# Altium project Onduleur.PrjPcb
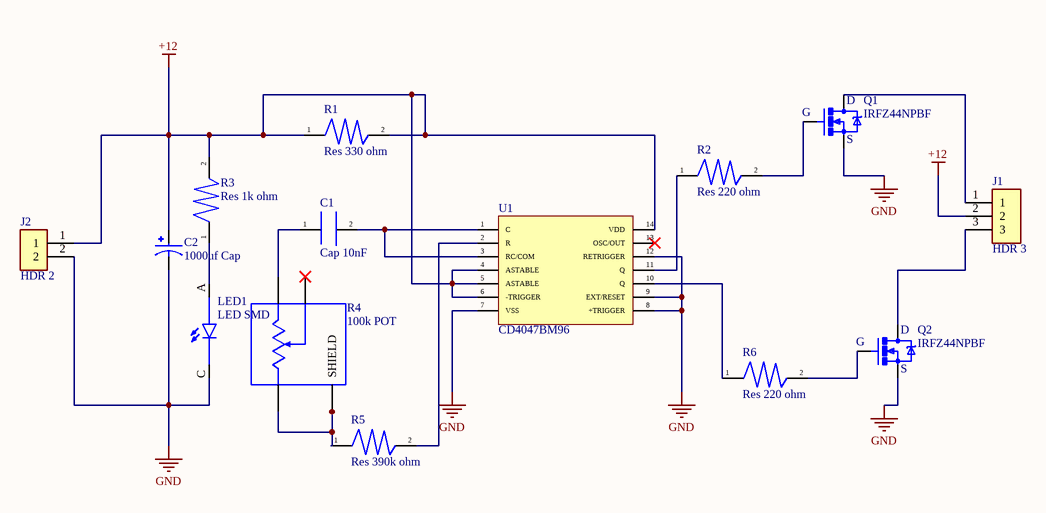
[diagram p0: onduleur.SchDoc]
1 sheet, 14 parts. Net scope: global (net labels, ports and power ports of the same name join across sheets).
Board file: PCB_onduleur.PcbDoc

## Sheet onduleur.SchDoc
size A; SheetNumber: 1; SheetTotal: 1

### Parts
C1  Cap 10nF  [C0805 10nf]
C2  1000uf Cap  [Cap 1000uf]
J1  HDR 3  [HDR 3]
J2  HDR 2  [HDR 2]
LED1  LED SMD  [LED]
Q1  IRFZ44NPBF  [IRF]
Q2  IRFZ44NPBF  [IRF]
R1  Res 330 ohm  [R2010 330 ohm]
R2  Res 220 ohm  [R2512 220ohm]
R3  Res 1k ohm  [R2512 390k]
R4  100k POT  [100k POt]
R5  Res 390k ohm  [R2512 390k]
R6  Res 220 ohm  [R2512 220ohm]
U1  CD4047BM96  [CD4047_SOP14]

### Nets
+12: C2.P J1.2 J2.1 R1.1 R1.2 R3.2 U1.4(ASTABLE) U1.5(ASTABLE) U1.6(-TRIGGER) U1.14(VDD)
GND: C2.N J2.2 LED1.C Q1.3(S) Q2.3(S) U1.7(VSS) U1.8(+TRIGGER) U1.9(EXT/RESET) U1.12(RETRIGGER)
NetC1_1: C1.1 R4.3
NetC1_2: C1.2 U1.1(C) U1.3(RC/COM)
NetJ1_1: J1.1 Q1.2(D)
NetJ1_3: J1.3 Q2.2(D)
NetLED1_A: LED1.A R3.1
NetQ1_1: Q1.1(G) R2.2
NetQ2_1: Q2.1(G) R6.2
NetR2_1: R2.1 U1.11(Q)
NetR4_1: R4.1 R4.S1(SHIELD) R4.S2(SHIELD) R5.1
NetR5_2: R5.2 U1.2(R)
NetR6_1: R6.1 U1.10(Q)

Not connected (* = marked no-connect by the designer): R4 2*; U1 13(OSC/OUT)*

### Library data of the parts
C1 = Cap 10nF: 0805 330 nF 25 V -20 / +80 % Tolerance Y5V SMT Multilayer Ceramic Capacitor; Manufacturer: Kyocera AVX; Manufacturer Part Number: 08053G334ZAT2A; Capacitance: 330nF; Voltage Rating (DC): 25V; Tolerance: 80%; Supplier 1: Digi-Key; RoHS: Yes; Category: Ceramic Capacitors; Stock 1: 7037; Pricing 1: 1=0.33000, 10=0.22400, 50=0.14920, 100=0.12680, 500=0.08950, 1000=0.07831 (USD); Mount: Surface Mount; Case/Package: 0805; Number of Pins: 2; Case Code (Imperial): 0805; Case Code (Metric): 2012; Contact Plating: Tin,Matte; Min Operating Temperature: -30°C; Max Operating Temperature: 85°C; Dielectric: Y5V; Voltage Rating: 25V; Packaging: Tape and Reel; Package Quantity: 1; Termination: SMD/SMT; Series: -; Construction: Flat; Length: 0.079inch; Width: 0.049inch; Height: 0.94mm; Thickness: 0.05inch; Depth: 1.25mm; Radiation Hardening: No; Lead Free: Lead Free; REACH SVHC: No SVHC; RoHS Compliant: Yes; ComponentLink1URL: https://datasheet.ciiva.com/15212/getdatasheetpartid-200149-15212519.pdf?src-supplier=Verical; ComponentLink1Description: https://datasheet.ciiva.com/15212/getdatasheetpartid-200149-15212519.pdf?src-supplier=Verical; ComponentLink2URL: https://datasheet.ciiva.com/152/cy5v-152205.pdf?src-supplier=Digi-Key; ComponentLink2Description: https://datasheet.ciiva.com/152/cy5v-152205.pdf?src-supplier=Digi-Key; ComponentLink3URL: https://datasheet.ciiva.com/152/cy5v-152206.pdf?src-supplier=Digi-Key; ComponentLink3Description: https://datasheet.ciiva.com/152/cy5v-152206.pdf?src-supplier=Digi-Key; ComponentLink4URL: https://datasheet.ciiva.com/152/cy5v-152207.pdf?src-supplier=Digi-Key; ComponentLink4Description: https://datasheet.ciiva.com/152/cy5v-152207.pdf?src-supplier=Digi-Key
C2 = 1000uf Cap: Cap Aluminum 1000uF 50V 20% (12.5 X 25mm) Radial 5mm 950mA 2000 hr 105°C Ammo Pack; Manufacturer: Panasonic; Manufacturer Part Number: EEU-HD1H102B; Capacitance: 1mF; Lead/Base Style: Straight; Life (Hours): 2000Hour; Lead Diameter: 0.6mm; Supplier 1: Digi-Key; RoHS: Yes; Category: Aluminum Electrolytic Capacitors; Stock 1: 1; Pricing 1: 1=2.69000, 10=2.17900, 50=1.90140, 100=1.66370 (USD); Mount: Through Hole; Case/Package: Radial; Min Operating Temperature: -55°C; Max Operating Temperature: 105°C; Package Quantity: 500; Voltage Rating: 50V; Tolerance: 20%; Ripple Current: 950mA; Packaging: Tape and Reel; Voltage Rating (DC): 50V; Features: General Purpose; Termination: Radial; Diameter: 12.5mm; Length: 25mm; Lead Pitch: 5mm; Height - Seated (Max): 1.063inch; ComponentLink1URL: https://datasheet.ciiva.com/30260/32aba0000ce137-30260380.pdf?src-supplier=Onlinecomponents.com; ComponentLink1Description: https://datasheet.ciiva.com/30260/32aba0000ce137-30260380.pdf?src-supplier=Onlinecomponents.com; ComponentLink2URL: https://datasheet.ciiva.com/24071/aba0000ce137-71750-24071852.pdf?src-supplier=Mouser; ComponentLink2Description: https://datasheet.ciiva.com/24071/aba0000ce137-71750-24071852.pdf?src-supplier=Mouser
J1 = HDR 3: 3 Position Wire to Board Terminal Block Horizontal with Board 0.150" (3.81mm) Through Hole; Manufacturer: TE Connectivity; Manufacturer Part Number: 284392-3; Supplier 1: Newark; RoHS: Yes; Category: Terminal Blocks; Stock 1: 2108; Pricing 1: 1=0.49100, 10=0.49100, 25=0.49100, 50=0.49100, 100=0.49100 (USD); ComponentLink1URL: https://datasheet.ciiva.com/823/eng-cd-284392-b1-823460.pdf?src-supplier=Digi-Key; ComponentLink1Description: https://datasheet.ciiva.com/823/eng-cd-284392-b1-823460.pdf?src-supplier=Digi-Key; ComponentLink2URL: https://datasheet.ciiva.com/15169/getdatasheetpartid-47322-15169431.pdf?src-supplier=Verical; ComponentLink2Description: https://datasheet.ciiva.com/15169/getdatasheetpartid-47322-15169431.pdf?src-supplier=Verical; ComponentLink3URL: https://datasheet.ciiva.com/9370/eng-cs-1308389-eurostyle-terminal-blocks-0607-9370189.pdf?src-supplier=Avnet; ComponentLink3Description: https://datasheet.ciiva.com/9370/eng-cs-1308389-eurostyle-terminal-blocks-0607-9370189.pdf?src-supplier=Avnet
J2 = HDR 2: Conn Terminal Block 2 POS 5.08mm Solder ST Thru-Hole 17.5A/Contact; Manufacturer: TE Connectivity; Manufacturer Part Number: 282841-2; Supplier 1: RSComponents; RoHS: Yes; Category: Terminal Blocks; Stock 1: 155; Pricing 1: 5=1.21300, 125=0.71100, 375=0.60700, 1000=0.51500, 2000=0.49400 (USD); ComponentLink1URL: https://datasheet.ciiva.com/11758/0900766b80e7dc90-11758676.pdf?src-supplier=RSComponents; ComponentLink1Description: https://datasheet.ciiva.com/11758/0900766b80e7dc90-11758676.pdf?src-supplier=RSComponents; ComponentLink2URL: https://datasheet.ciiva.com/15225/getdatasheetpartid-155859-15225932.pdf?src-supplier=Verical; ComponentLink2Description: https://datasheet.ciiva.com/15225/getdatasheetpartid-155859-15225932.pdf?src-supplier=Verical; ComponentLink3URL: https://datasheet.ciiva.com/30126/eng-cs-1308389-eurostyle-terminal-blocks-0607-30126654.pdf?src-supplier=Onlinecomponents.com; ComponentLink3Description: https://datasheet.ciiva.com/30126/eng-cs-1308389-eurostyle-terminal-blocks-0607-30126654.pdf?src-supplier=Onlinecomponents.com; ComponentLink4URL: https://datasheet.ciiva.com/823/eng-cd-282841-h6-823441.pdf?src-supplier=Digi-Key; ComponentLink4Description: https://datasheet.ciiva.com/823/eng-cd-282841-h6-823441.pdf?src-supplier=Digi-Key
LED1 = LED SMD: LED RED CLEAR 1206 SMD; Manufacturer: Vishay Lite-On; Manufacturer Part Number: LTST-C230KRKT; Lens Color: Colorless; Viewing Angle: 130°; Luminous Intensity: 54mcd; Forward Voltage: 2V; Dominant Wavelength: 631nm; Test Current: 20mA; Wavelength: 639nm; Lens Style: Diffused,Colorless,Rectangular,Clear; Forward Current: 30mA; Power Rating: 75mW; Number of Elements: 1; Reverse Voltage: 5V; Supplier 1: Digi-Key; RoHS: Yes; Category: LEDs; Stock 1: 672275; Pricing 1: 1=0.31000, 10=0.16600, 100=0.07700, 500=0.07110, 1000=0.05570 (USD); Mount: Surface Mount; Case/Package: 1206; Number of Pins: 2; Color: Red; Case Code (Metric): 3216; Case Code (Imperial): 1206; Min Operating Temperature: -55°C; Max Operating Temperature: 85°C; Package Quantity: 1; Packaging: Tape and Reel; Lens Transparency: Clear; Illumination Color: Red; Power Dissipation: 75mW; Number of LEDs: 1; Length: 3.2mm; Width: 1.6mm; Height: 1.1mm; Depth: 1.6mm; Radiation Hardening: No; Lead Free: Lead Free; RoHS Compliant: Yes; ComponentLink1URL: https://datasheet.ciiva.com/11774/0900766b80dc057b-11774044.pdf?src-supplier=RSComponents; ComponentLink1Description: https://datasheet.ciiva.com/11774/0900766b80dc057b-11774044.pdf?src-supplier=RSComponents; ComponentLink2URL: https://datasheet.ciiva.com/12400/lite-on-ltst-c230krkt-187437-12400814.pdf?src-supplier=Mouser; ComponentLink2Description: https://datasheet.ciiva.com/12400/lite-on-ltst-c230krkt-187437-12400814.pdf?src-supplier=Mouser; ComponentLink3URL: https://datasheet.ciiva.com/4266/dwonloadfilehandler-ashxtxtspecnods22-2000-253-ashxtxtspecnods22-2000-253-4266917.pdf?src-supplier=Arrow+Electronics; ComponentLink3Description: https://datasheet.ciiva.com/4266/dwonloadfilehandler-ashxtxtspecnods22-2000-253-ashxtxtspecnods22-2000-253-4266917.pdf?src-supplier=Arrow+Electronics; ComponentLink4URL: https://datasheet.ciiva.com/16444/ltst-c230krkt-16444734.pdf?src-supplier=Future+Electronics; ComponentLink4Description: https://datasheet.ciiva.com/16444/ltst-c230krkt-16444734.pdf?src-supplier=Future+Electronics; ComponentLink5URL: https://datasheet.ciiva.com/15117/getdatasheetpartid-144017-15117804.pdf?src-supplier=Verical; ComponentLink5Description: https://datasheet.ciiva.com/15117/getdatasheetpartid-144017-15117804.pdf?src-supplier=Verical; ComponentLink6URL: https://datasheet.ciiva.com/2110/s-110-ltst-c230krkt-2110049.pdf?src-supplier=Digi-Key; ComponentLink6Description: https://datasheet.ciiva.com/2110/s-110-ltst-c230krkt-2110049.pdf?src-supplier=Digi-Key; ComponentLink7URL: https://datasheet.ciiva.com/2110/s-110-ltst-c230krkt-2110048.pdf?src-supplier=Digi-Key; ComponentLink7Description: https://datasheet.ciiva.com/2110/s-110-ltst-c230krkt-2110048.pdf?src-supplier=Digi-Key; ComponentLink8URL: https://datasheet.ciiva.com/2110/s-110-ltst-c230krkt-2110050.pdf?src-supplier=Digi-Key; ComponentLink8Description: https://datasheet.ciiva.com/2110/s-110-ltst-c230krkt-2110050.pdf?src-supplier=Digi-Key
Q1 Q2 = IRFZ44NPBF: N沟道 VDS=55V VGS=±20V ID=49A; Manufacturer: Infineon; Continuous Drain Current (ID): 49A; Gate to Source Voltage (Vgs): 20V; Rise Time: 60ns; Power Dissipation: 94W; Turn-Off Delay Time: 44ns; Turn-On Delay Time: 12ns; Drain to Source Voltage (Vdss): 55V; Rds On Max: 17.5mR; Input Capacitance: 1.47nF; Element Configuration: Single; Threshold Voltage: 4V; Supplier 1: Digi-Key; Manufacturer Part Number: IRFZ44NPBF; RoHS: Yes; Category: MOSFETs; Stock 1: 3296; Pricing 1: 1=1.58000, 10=1.41400, 100=1.10210, 500=0.91040, 1000=0.79860 (USD); Mount: Through Hole; Case/Package: TO-220; Number of Pins: 3; Contact Plating: Tin,Matte; Min Operating Temperature: -55°C; Max Operating Temperature: 175°C; Packaging: Rail/Tube; Max Power Dissipation: 94W; Drain to Source Resistance: 17.5mR; Drain to Source Breakdown Voltage: 55V; Max Dual Supply Voltage: 55V; Length: 0.42inch; Width: 0.19inch; Height: 0.65inch; REACH SVHC: No SVHC; Lead Free: Lead Free; RoHS Compliant: Yes; Halogen Free: Halogen Free; ComponentLink1URL: https://www.alliedelec.com/m/d/ec90d67249a68ee89112b87fffe18402.pdf?src-supplier=Allied+Electronics; ComponentLink1Description: https://www.alliedelec.com/m/d/ec90d67249a68ee89112b87fffe18402.pdf?src-supplier=Allied+Electronics; ComponentLink2URL: http://www.farnell.com/datasheets/1916237.pdf?src-supplier=Element14; ComponentLink2Description: http://www.farnell.com/datasheets/1916237.pdf?src-supplier=Element14; ComponentLink3URL: https://www.infineon.com/dgdl/irfz44npbf.pdf?fileId=5546d462533600a40153563b3a9f220d&src-supplier=Digi-Key; ComponentLink3Description: https://www.infineon.com/dgdl/irfz44npbf.pdf?fileId=5546d462533600a40153563b3a9f220d&src-supplier=Digi-Key
R1 = Res 330 ohm: Res Thick Film 2010 330 Ohm 1% 1W ±100ppm/°C Molded SMD SMD Paper T/R; Manufacturer: Stackpole Electronics; Manufacturer Part Number: RMCP2010FT330R; Resistance: 330R; Supplier 1: Digi-Key; RoHS: Yes; Category: Chip SMD Resistors; Stock 1: 4772; Pricing 1: 1=0.52000, 10=0.39700, 100=0.16680, 1000=0.09200 (USD); Case/Package: 2010; Case Code (Metric): 5025; Case Code (Imperial): 2010; Min Operating Temperature: -55°C; Max Operating Temperature: 155°C; Power Rating: 1W; Tolerance: 1%; Packaging: Tape and Reel; Resistor Type: Thick Film; Number of Terminations: 2; Max Power Dissipation: 1W; Temperature Coefficient: 100ppm/°C; Series: RMCP; Length: 0.197inch; Width: 0.098inch; Height: 0.028inch; Radiation Hardening: No; Lead Free: Lead Free; RoHS Compliant: Yes; ComponentLink1URL: https://www.seielect.com/catalog/SEI-RMCF_RMCP.pdf?src-supplier=Avnet; ComponentLink1Description: https://www.seielect.com/catalog/SEI-RMCF_RMCP.pdf?src-supplier=Avnet; ComponentLink2URL: https://www.seielect.com/Catalog/SEI-RMCF_RMCP.pdf?src-supplier=Digi-Key; ComponentLink2Description: https://www.seielect.com/Catalog/SEI-RMCF_RMCP.pdf?src-supplier=Digi-Key
R2 R6 = Res 220 ohm: Res Thick Film 2512 220 Ohm 1% 1W ±100ppm/°C Pad SMD T/R; Manufacturer: Yageo; Manufacturer Part Number: RC2512FK-07220RL; Resistance: 220R; Voltage Rating: 200V; Supplier 1: Digi-Key; RoHS: Yes; Category: Chip SMD Resistors; Stock 1: 35; Pricing 1: 1=0.47000, 10=0.33400, 100=0.13370, 1000=0.06588 (USD); Case/Package: 2512; Contact Plating: Tin,Matte; Case Code (Imperial): 2512; Case Code (Metric): 6432; Min Operating Temperature: -55°C; Max Operating Temperature: 155°C; Tolerance: 1%; Power Rating: 1W; Resistor Type: Thick Film; Temperature Coefficient: 100ppm/°C; Packaging: Tape and Reel; Number of Terminations: 2; Termination: SMD/SMT; Max Power Dissipation: 1W; Features: Moisture Resistant; Series: RC; Resistance Tolerance: 1%; Construction: Rectangular; Length: 6.35mm; Width: 0.122inch; Height: 0.026inch; Depth: 3.1mm; Radiation Hardening: No; REACH SVHC: Unknown; Military Standard: Not; RoHS Compliant: Yes; ComponentLink1URL: https://datasheet.ciiva.com/12561/pyu-rc2512-51-rohs-l-4-12561947.pdf?src-supplier=Mouser; ComponentLink1Description: https://datasheet.ciiva.com/12561/pyu-rc2512-51-rohs-l-4-12561947.pdf?src-supplier=Mouser; ComponentLink2URL: https://datasheet.ciiva.com/7671/638316-7671973.pdf?src-supplier=Element14; ComponentLink2Description: https://datasheet.ciiva.com/7671/638316-7671973.pdf?src-supplier=Element14
R3 = Res 1k ohm: 贴片电阻 1KΩ 1KΩ ±5% 1W 2512; Manufacturer: Yageo; Manufacturer Part Number: RC2512JK-071KL; Resistance: 1kR; Voltage Rating: 200V; Temperature Coefficient: 100ppm/°C; Supplier 1: Digi-Key; RoHS: Yes; Category: Chip SMD Resistors; Stock 1: 1409; Pricing 1: 1=0.36000, 10=0.30100, 100=0.11750, 1000=0.04918 (USD); Case/Package: 2512; Case Code (Imperial): 2512; Case Code (Metric): 6432; Contact Plating: Tin,Lead; Min Operating Temperature: -55°C; Max Operating Temperature: 155°C; Power Rating: 1W; Packaging: Tape and Reel; Tolerance: 5%; Resistor Type: Thick Film; Number of Terminations: 2; Termination: SMD/SMT; Max Power Dissipation: 1W; Working Voltage: 200V; Features: Moisture Resistant; Series: RC; Technology: THICK FILM; Resistance Tolerance: 5%; Construction: Rectangular; Length: 6.35mm; Width: 0.122inch; Height: 0.026inch; Depth: 3.1mm; REACH SVHC: Unknown; Military Standard: Not; Lead Free: Lead Free; RoHS Compliant: Yes; ComponentLink1URL: https://datasheet.ciiva.com/5595/pyu-rc2512-51-rohs-l-4-5595927.pdf?src-supplier=Mouser; ComponentLink1Description: https://datasheet.ciiva.com/5595/pyu-rc2512-51-rohs-l-4-5595927.pdf?src-supplier=Mouser; ComponentLink2URL: https://datasheet.ciiva.com/7672/638316-7672039.pdf?src-supplier=Element14; ComponentLink2Description: https://datasheet.ciiva.com/7672/638316-7672039.pdf?src-supplier=Element14; ComponentLink3URL: https://datasheet.ciiva.com/7672/638316-7672038.pdf?src-supplier=Element14; ComponentLink3Description: https://datasheet.ciiva.com/7672/638316-7672038.pdf?src-supplier=Element14
R4 = 100k POT: Res Conductive Plastic POT 100K Ohm 20% 0.05W(1/20W) 1(Elec)/1(Mech)Turn 6mm Pin Panel Mount/Through Hole; Manufacturer: TT BI; Manufacturer Part Number: P0915N-FC15BR100K; Resistance: 100kR; Power Rating: 50mW; Voltage Rating (AC): 50V; Number of Gangs: 1; Actuator Length: 0.591inch; Actuator Diameter: 0.236inch; Supplier 1: Digi-Key; RoHS: Yes; Category: Uncategorized; Stock 1: 24101; Pricing 1: 1=2.23000, 10=1.96200, 25=1.75960, 40=1.69175, 80=1.62413, 230=1.55639, 440=1.28573, 1820=1.21806, 5460=1.01505 (USD); Mount: Panel; Min Operating Temperature: -10°C; Max Operating Temperature: 70°C; Tolerance: 20%; Packaging: Tray; Taper: Linear; Number of Turns: 1; Termination: PC Pins; Resistor Type: Conductive Plastic; Max Power Dissipation: 50mW; Series: P09x; RoHS Compliant: Yes; ComponentLink1URL: http://components.arrow.com/part/dataview/47585689S8708286N1290?src-supplier=Arrow+Electronics; ComponentLink1Description: http://components.arrow.com/part/dataview/47585689S8708286N1290?src-supplier=Arrow+Electronics; ComponentLink2URL: http://www.ttelectronics.com/sites/default/files/download-files/Datasheet_PanelPot_P09xSeries.pdf?src-supplier=Digi-Key; ComponentLink2Description: http://www.ttelectronics.com/sites/default/files/download-files/Datasheet_PanelPot_P09xSeries.pdf?src-supplier=Digi-Key
R5 = Res 390k ohm: Res Thick Film 2512 390K Ohm 5% 1W ±200ppm/°C Molded SMD Embossed Carrier T/R; Manufacturer: Panasonic; Manufacturer Part Number: ERJ-1TYJ394U; Resistance: 390kR; Voltage Rating: 200V; Voltage Rating (DC): 250V; Supplier 1: Digi-Key; RoHS: Yes; Category: Chip SMD Resistors; Stock 1: 6038; Pricing 1: 1=0.72000, 10=0.51500, 100=0.26780, 1000=0.14420 (USD); Mount: Surface Mount; Case/Package: 2512; Case Code (Metric): 6432; Case Code (Imperial): 2512; Contact Plating: Tin; Min Operating Temperature: -55°C; Max Operating Temperature: 155°C; Power Rating: 1W; Tolerance: 5%; Packaging: Tape and Reel; Package Quantity: 4000; Resistor Type: Thick Film; Number of Terminations: 2; Termination: SMD/SMT; Temperature Coefficient: 200ppm/°C; Max Power Dissipation: 1W; Series: ERJ; Resistance Tolerance: 5%; Length: 0.252inch; Width: 0.126inch; Height: 0.028inch; REACH SVHC: No SVHC; Lead Free: Contains Lead; RoHS Compliant: Yes; ComponentLink1URL: https://datasheet.ciiva.com/46379/1678796-46379782.pdf?src-supplier=Element14; ComponentLink1Description: https://datasheet.ciiva.com/46379/1678796-46379782.pdf?src-supplier=Element14; ComponentLink2URL: https://datasheet.ciiva.com/9182/aoa0000ce1-9182431.pdf?src-supplier=Avnet; ComponentLink2Description: https://datasheet.ciiva.com/9182/aoa0000ce1-9182431.pdf?src-supplier=Avnet
U1 = CD4047BM96: IC MONO/ASTBL MULTVIBRTR 14SOIC; Manufacturer: Texas Instruments; Propagation Delay: 125ns; Output Current: 6.8A; Min Supply Voltage: 3V; Max Supply Voltage: 18V; Number of Elements: 1; High Level Output Current: -4.2mA; Low Level Output Current: 4.2mA; Turn-On Delay Time: 300ns; Logic Function: Multivibrator; Quiescent Current: 20uA; Schmitt Trigger Input: No; Operating Supply Voltage: 12V; Supplier 1: Digi-Key; Manufacturer Part Number: CD4047BM96; RoHS: Yes; Category: Timers and Oscillators; Stock 1: 1690; Pricing 1: 1=0.65000, 10=0.55300, 25=0.51560, 100=0.41260, 250=0.38308, 500=0.32414, 1000=0.25048 (USD); Mount: Surface Mount; Case/Package: SOIC; Number of Pins: 14; Weight: 0.004564oz; Contact Plating: Gold; Min Operating Temperature: -55°C; Max Operating Temperature: 125°C; Packaging: Tape and Reel; Package Quantity: 2500; Independent Circuits: 1; Number of Bits: 1; Series: 4000B; Technology: CMOS; Max Supply Current: 20uA; Length: 8.65mm; Width: 3.91mm; Height: 1.58mm; Radiation Hardening: No; Lead Free: Lead Free; RoHS Compliant: Yes; REACH SVHC: No SVHC; ComponentLink1URL: https://datasheet.ciiva.com/41677/1830980-41677270.pdf?src-supplier=Newark; ComponentLink1Description: https://datasheet.ciiva.com/41677/1830980-41677270.pdf?src-supplier=Newark; ComponentLink2URL: https://datasheet.ciiva.com/14286/cd4047b-14286761.pdf?src-supplier=Avnet; ComponentLink2Description: https://datasheet.ciiva.com/14286/cd4047b-14286761.pdf?src-supplier=Avnet